# EasyEDA Pro project ProPrj_Practice 4 layer_2025-09-09.epro, schematic 4 Analog Outputs
Board Name: 4 Analog Outputs; Create Date: 2025-08-13; Page Name: P1; Project Name: Practice 4 layer; Schematic Name: 4 Analog Outputs; Update Date: 2025-08-21; Company: EasyEDA.com; Page Size: A4; Version: V1.0
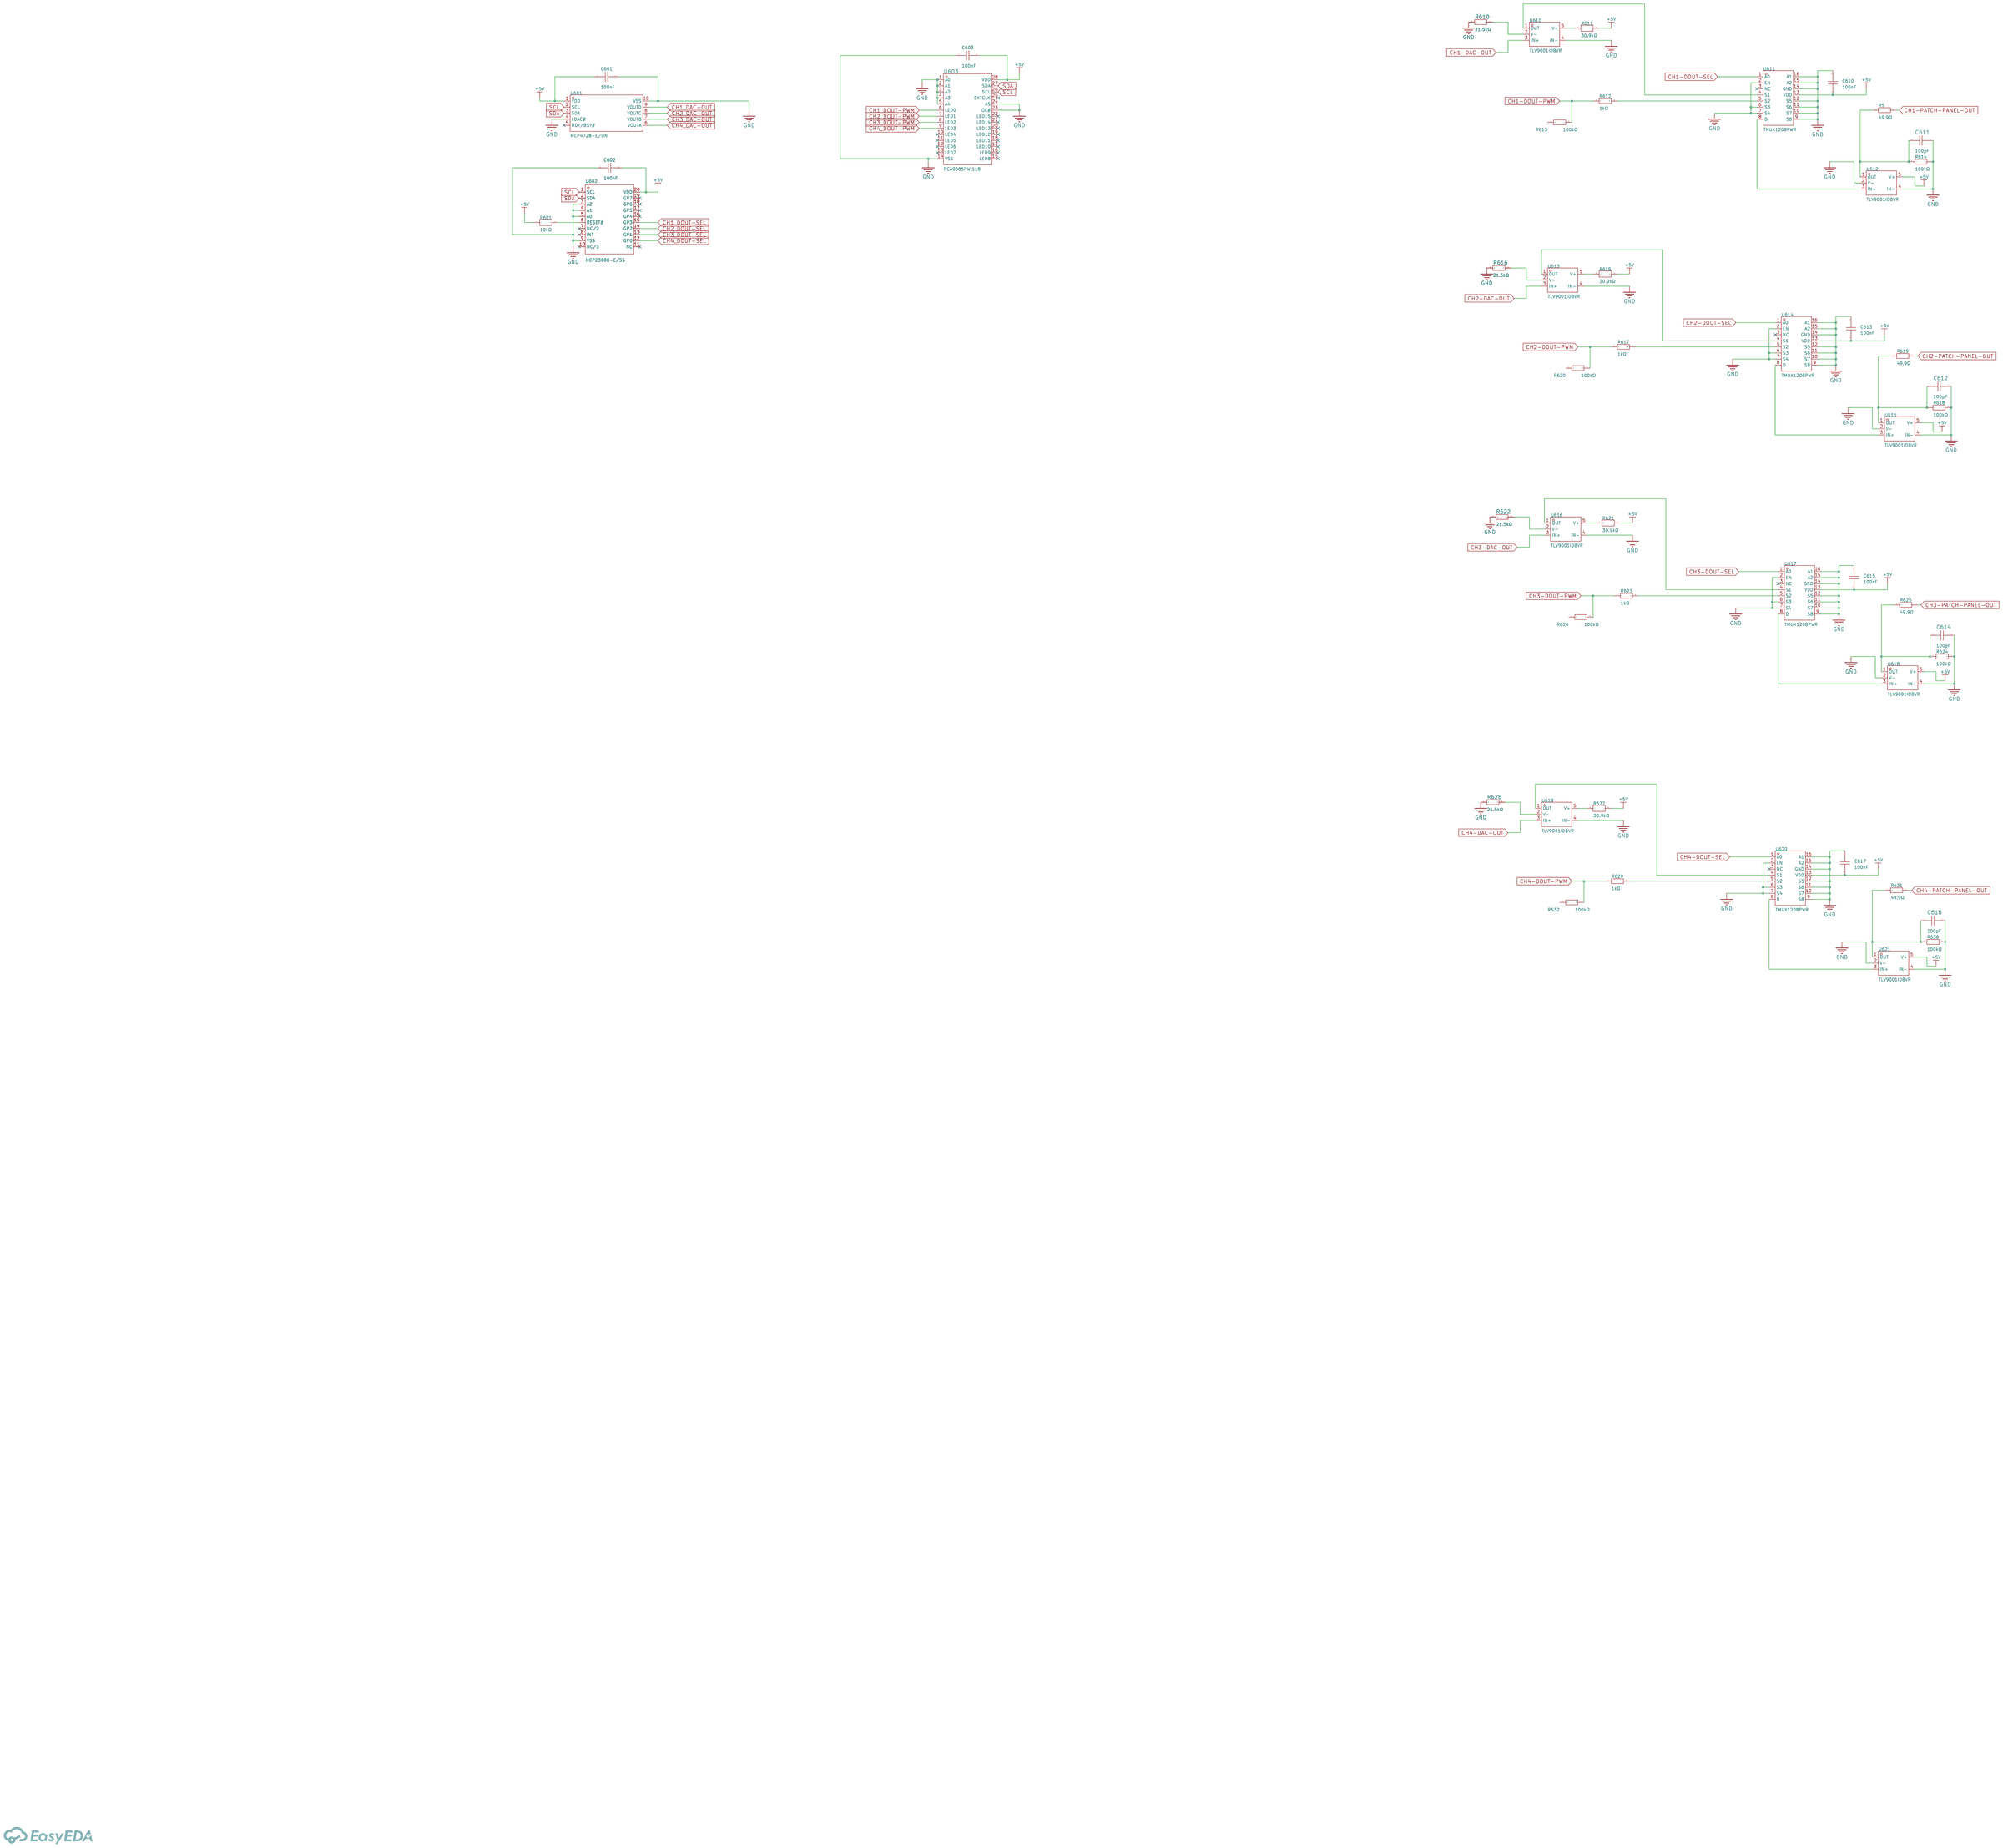
[diagram p8: schematic sheet]

## Parts
C601  100nF  [C0603]
C602  100nF  [C0603]
C603  100nF  [C0603]
C610  100nF  [C0603]
C611  100pF  [C0603]
C612  100pF  [C0603]
C613  100nF  [C0603]
C614  100pF  [C0603]
C615  100nF  [C0603]
C616  100pF  [C0603]
C617  100nF  [C0603]
R5  49.9Ω  [R0603]
R601  10kΩ  [R0603]
R610  21.5kΩ  [R0402]
R611  30.9kΩ  [R0603]
R612  1kΩ  [R0603]
R613  100kΩ  [R0603]
R614  100kΩ  [R0603]
R615  30.9kΩ  [R0603]
R616  21.5kΩ  [R0402]
R617  1kΩ  [R0603]
R618  100kΩ  [R0603]
R619  49.9Ω  [R0603]
R620  100kΩ  [R0603]
R621  30.9kΩ  [R0603]
R622  21.5kΩ  [R0402]
R623  1kΩ  [R0603]
R624  100kΩ  [R0603]
R625  49.9Ω  [R0603]
R626  100kΩ  [R0603]
R627  30.9kΩ  [R0603]
R628  21.5kΩ  [R0402]
R629  1kΩ  [R0603]
R630  100kΩ  [R0603]
R631  49.9Ω  [R0603]
R632  100kΩ  [R0603]
U601  MCP4728-E/UN  [MSOP-10_L3.0-W3.0-P0.50-LS5.0-TL]
U602  MCP23008-E/SS  [SSOP-20_L7.2-W5.3-P0.65-LS7.8-BL]
U603  PCA9685PW,118  [TSSOP-28_L9.7-W4.4-P0.65-LS6.4-TL]
U610  TLV9001IDBVR  [SOT-23-5_L3.0-W1.7-P0.95-LS2.8-BR]
U611  TMUX1208PWR  [TSSOP-16_L5.0-W4.4-P0.65-LS6.4-BL]
U612  TLV9001IDBVR  [SOT-23-5_L3.0-W1.7-P0.95-LS2.8-BR]
U613  TLV9001IDBVR  [SOT-23-5_L3.0-W1.7-P0.95-LS2.8-BR]
U614  TMUX1208PWR  [TSSOP-16_L5.0-W4.4-P0.65-LS6.4-BL]
U615  TLV9001IDBVR  [SOT-23-5_L3.0-W1.7-P0.95-LS2.8-BR]
U616  TLV9001IDBVR  [SOT-23-5_L3.0-W1.7-P0.95-LS2.8-BR]
U617  TMUX1208PWR  [TSSOP-16_L5.0-W4.4-P0.65-LS6.4-BL]
U618  TLV9001IDBVR  [SOT-23-5_L3.0-W1.7-P0.95-LS2.8-BR]
U619  TLV9001IDBVR  [SOT-23-5_L3.0-W1.7-P0.95-LS2.8-BR]
U620  TMUX1208PWR  [TSSOP-16_L5.0-W4.4-P0.65-LS6.4-BL]
U621  TLV9001IDBVR  [SOT-23-5_L3.0-W1.7-P0.95-LS2.8-BR]

## Library data of the parts
C601-C603 C610 C613 C615 C617 = CC0603KRX7R9BB104: Capacitance:100nF Tolerance:±10% Tolerance:±10% Voltage Rating:50V Temperature Coefficient:X7R; LCSC Part Name: 100nF ±10% 50V; Supplier Part: C14663; Manufacturer: YAGEO(国巨); Supplier Footprint: 0603; JLCPCB Part Class: Basic Part; Datasheet: https://atta.szlcsc.com/upload/public/pdf/source/20250214/096C4C206003071F5D32E5F0D8E7F8DF.pdf; Supplier: LCSC; Tolerance: ±10%; Voltage Rating: 50V; Temperature Coefficient: X7R
C611 C612 C614 C616 = CC0603JRNPO9BN101: Capacitance: Tolerance:±5% Tolerance:±5% Voltage Rated: Temperature Coefficient:; LCSC Part Name: 100pF ±5% 50V; Supplier Part: C14665; Manufacturer: YAGEO(国巨); Supplier Footprint: 0603; JLCPCB Part Class: Extended Part; Datasheet: https://atta.szlcsc.com/upload/public/pdf/source/20181008/C309499_21CC21451B82C39E3D92150FD6B30293.pdf; Supplier: LCSC; Tolerance: ±5%
R5 R619 R625 R631 = 0603WAF499JT5E_C23185: Type:Thick Film Resistor Resistance:49.9Ω Tolerance:±1% Tolerance:±1% Power(Watts):100mW Voltage-Supply(Max):75V Temperature Coefficient:±100ppm/℃ Temperature Coefficient:±100ppm/℃ Operating Temperature:-55℃~+155℃ Operating Temperature:-55℃~+155℃; LCSC Part Name: 49.9Ω ±1% 100mW 厚膜电阻; Supplier Part: C23185; Manufacturer: UNI-ROYAL(厚声); Manufacturer Part: 0603WAF499JT5E; Supplier Footprint: 0603; JLCPCB Part Class: Basic Part; Datasheet: https://item.szlcsc.com/datasheet/0603WAF499JT5E/23912.html; Supplier: LCSC; Type: Thick Film Resistor; Tolerance: ±1%; Power(Watts): 100mW; Voltage-Supply(Max): 75V; Temperature Coefficient: ±100ppm/℃; Operating Temperature: -55℃~+155℃
R601 = FRC0603J103 TS: Type:Thick Film Resistors Resistance:10kΩ Tolerance:±5% Tolerance:±5% Power(Watts):0.1W Voltage-Supply(Max):75V Temperature Coefficient:±100ppm/℃ Temperature Coefficient:±100ppm/℃ Operating Temperature:-55℃~+155℃ Operating Temperature:-55℃~+155℃; LCSC Part Name: 10kΩ ±5% 100mW 厚膜电阻; Supplier Part: C2930027; Manufacturer: FOJAN(富捷); Supplier Footprint: 0603; JLCPCB Part Class: Extended Part; Datasheet: https://atta.szlcsc.com/upload/public/pdf/source/20211221/925EC7D7225764EE0046F22065062C87.pdf; Supplier: LCSC; Type: Thick Film Resistors; Tolerance: ±5%; Power(Watts): 0.1W; Voltage-Supply(Max): 75V; Temperature Coefficient: ±100ppm/℃; Operating Temperature: -55℃~+155℃
R610 R616 R622 R628 = 0402WGF2152TCE: Type:Thick Film Resistor Resistance:21.5kΩ Tolerance:±1% Tolerance:±1% Power(Watts):62.5mW Voltage-Supply(Max):50V Temperature Coefficient:±100ppm/℃ Temperature Coefficient:±100ppm/℃ Operating Temperature:-55℃~+155℃ Operating Temperature:-55℃~+155℃; LCSC Part Name: 21.5kΩ ±1% 62.5mW 厚膜电阻; Supplier Part: C25872; Manufacturer: UNI-ROYAL(厚声); Supplier Footprint: 0402; JLCPCB Part Class: Extended Part; Datasheet: https://item.szlcsc.com/datasheet/0402WGF2152TCE/26615.html; Supplier: LCSC; Type: Thick Film Resistor; Tolerance: ±1%; Power(Watts): 62.5mW; Voltage-Supply(Max): 50V; Temperature Coefficient: ±100ppm/℃; Operating Temperature: -55℃~+155℃
R611 R615 R621 R627 = FRC0603F3092TS: Type:Thick Film Resistor Resistance:30.9kΩ Tolerance:±1% Tolerance:±1% Power(Watts):100mW Voltage-Supply(Max):75V Temperature Coefficient:±100ppm/℃ Temperature Coefficient:±100ppm/℃ Operating Temperature:-55℃~+155℃ Operating Temperature:-55℃~+155℃; LCSC Part Name: 30.9kΩ ±1% 100mW 厚膜电阻; Supplier Part: C2930090; Manufacturer: FOJAN(富捷); Supplier Footprint: 0603; JLCPCB Part Class: Extended Part; Datasheet: https://item.szlcsc.com/datasheet/FRC0603F3092TS/3267023.html; Supplier: LCSC; Type: Thick Film Resistor; Tolerance: ±1%; Power(Watts): 100mW; Voltage-Supply(Max): 75V; Temperature Coefficient: ±100ppm/℃; Operating Temperature: -55℃~+155℃
R612 R617 R623 R629 = 0603WAJ0102T5E: Type:Thick Film Resistor Resistance:1kΩ Tolerance:±5% Tolerance:±5% Power(Watts):100mW Voltage-Supply(Max):75V Temperature Coefficient:±100ppm/℃ Temperature Coefficient:±100ppm/℃ Operating Temperature:-55℃~+155℃ Operating Temperature:-55℃~+155℃; LCSC Part Name: 1kΩ ±5% 100mW 厚膜电阻; Supplier Part: C25585; Manufacturer: UNI-ROYAL(厚声); Supplier Footprint: 0603; JLCPCB Part Class: Extended Part; Datasheet: https://item.szlcsc.com/datasheet/0603WAJ0102T5E/26328.html; Supplier: LCSC; Type: Thick Film Resistor; Tolerance: ±5%; Power(Watts): 100mW; Voltage-Supply(Max): 75V; Temperature Coefficient: ±100ppm/℃; Operating Temperature: -55℃~+155℃
R613 R614 R618 R620 R624 R626 R630 R632 = 0603WAF1003T5E: Type:Thick Film Resistors Resistance:100kΩ Tolerance:±1% Tolerance:±1% Power(Watts): Overload Voltage (Max): Temperature Coefficient:±100ppm/℃ Temperature Coefficient:±100ppm/℃ Operating Temperature Range:-55℃~+155℃ Operating Temperature Range:-55℃~+155℃; LCSC Part Name: 100kΩ ±1% 100mW 厚膜电阻; Supplier Part: C25803; Manufacturer: UNI-ROYAL(厚声); Supplier Footprint: 0603; JLCPCB Part Class: Basic Part; Datasheet: https://atta.szlcsc.com/upload/public/pdf/source/20200306/C422600_1E6D84923E4A46A82E41ADD87F860B5C.pdf; Supplier: LCSC; Type: Thick Film Resistors; Tolerance: ±1%; Temperature Coefficient: ±100ppm/℃; Operating Temperature Range: -55℃~+155℃
U601 = MCP4728-E/UN: Resolution(Bits):12Bit Number of Channels:4 Interface:I2C Voltage - Supply:2.7V~5.5V Voltage - Supply:2.7V~5.5V Settling Time:6us Output Type:- INL/DNL(LSB):2LSB INL/DNL(LSB):2LSB Operating Temperature:-40℃~+125℃ Operating Temperature:-40℃~+125℃; LCSC Part Name: F; Supplier Part: C108207; Manufacturer: MICROCHIP(美国微芯); Supplier Footprint: MSOP-10; JLCPCB Part Class: Extended Part; Datasheet: https://atta.szlcsc.com/upload/public/pdf/source/20180207/C108207_15179947749381359004.pdf; Supplier: LCSC; Resolution(Bits): 12Bit; Number of Channels: 4; Interface: I2C; Voltage - Supply: 2.7V~5.5V; Settling Time: 6us; INL/DNL(LSB): 2LSB; Operating Temperature: -40℃~+125℃
U602 = MCP23008-E/SS: Interface:I2C Number of I/O:8 Interrupt Output:With Interrupt Output Output Type: Supply Voltage:- Supply Voltage:- Output Source current:- Output Sink Current:- Clock Frequency:1.7MHz Operating Temperature:- Operating Temperature:-; LCSC Part Name: 8位I/O扩展器带串行接口; Supplier Part: C148011; Manufacturer: MICROCHIP(美国微芯); Supplier Footprint: SSOP-20-208mil; JLCPCB Part Class: Extended Part; Datasheet: https://atta.szlcsc.com/upload/public/pdf/source/20171228/C152205_15144475388971215001.pdf; Supplier: LCSC; Interface: I2C; Number of I/O: 8; Interrupt Output: With Interrupt Output; Clock Frequency: 1.7MHz
U603 = PCA9685PW,118: Type:- Voltage - Input(DC):2.3V~5.5V Voltage - Input(DC):2.3V~5.5V Frequency - Switching:100kHz~1MHz Frequency - Switching:100kHz~1MHz Number of Channels:16 Output Voltage:- Output Voltage:- Output Current:25mA Dimming:PWM Operating temperature:-40℃~+85℃; Supplier Part: C2678753; Manufacturer: NXP(恩智浦); Supplier Footprint: TSSOP-28; JLCPCB Part Class: Extended Part; Datasheet: https://www.nxp.com.cn/docs/en/data-sheet/PCA9685.pdf; Supplier: LCSC; Voltage - Input(DC): 2.3V~5.5V; Frequency - Switching: 100kHz~1MHz; Number of Channels: 16; Output Current: 25mA; Dimming: PWM; Operating temperature: -40℃~+85℃
U610 U612 U613 U615 U616 U618 U619 U621 = TLV9001IDBVR: Number of Channels:Single channel Maximum Power Supply Range (Vdd-Vss):5.5V Rail to Rail:- Gain Bandwidth Product:- Vos - Input Offset Voltage:1.6mV Input Offset Voltage Drift(Vos TC):0.6uV/℃ Slew Rate:2V/us Ib - Input Bias Current:5pA Input Offset Curren; Supplier Part: C398363; Manufacturer: TI(德州仪器); Supplier Footprint: SOT-23-5; JLCPCB Part Class: Extended Part; Datasheet: https://www.ti.com/cn/lit/gpn/tlv9001; Supplier: LCSC; Number of Channels: Single channel; Maximum Power Supply Range (Vdd-Vss): 5.5V; Vos - Input Offset Voltage: 1.6mV; Input Offset Voltage Drift(Vos TC): 0.6uV/℃; Slew Rate: 2V/us; Ib - Input Bias Current: 5pA; Noise density(eN): 4.7nV/√Hz@1kHz; Common Mode Rejection Ratio(CMRR): 86dB; Operating Temperature: -40℃~+125℃; Single supply: 1.8V~5.5V
U611 U614 U617 U620 = TMUX1208PWR: Switch Circuit:SP8T single pole eight throw Number of Channels:8 Supply Voltage:1.08V~5.5V Supply Voltage:1.08V~5.5V Turn-on time:48ns On-State Resistance (Max):9Ω Turn-off time:48ns Operating Temperature:-40℃~+125℃ Operating Temperature:-40℃~+125℃; LCSC Part Name: TMUX1208 5V 双向8:1单通道多路复用器; Supplier Part: C494728; Manufacturer: TI(德州仪器); Supplier Footprint: TSSOP-16; JLCPCB Part Class: Extended Part; Datasheet: https://www.ti.com/cn/lit/gpn/tmux1208; Supplier: LCSC; Switch Circuit: SP8T single pole eight throw; Number of Channels: 8; Supply Voltage: 1.08V~5.5V; Turn-on time: 48ns; On-State Resistance (Max): 9Ω; Turn-off time: 48ns; Operating Temperature: -40℃~+125℃

## Nets
+5V: C601.1 C602.2 C603.2 C610.1 C613.1 C615.1 C617.1 R601.2 R611.1 R615.1 R621.1 R627.1 U601.1(VDD) U602.20(VDD) U603.28(VDD) U611.13(VDD) U612.5(V+) U614.13(VDD) U615.5(V+) U617.13(VDD) U618.5(V+) U620.13(VDD) U621.5(V+)
GND: C601.2 C602.1 C603.1 C610.2 C611.2 C612.2 C613.2 C614.2 C615.2 C616.2 C617.2 R610.2 R614.2 R616.2 R618.2 R622.2 R624.2 R628.2 R630.2 U601.4(LDAC#) U601.10(VSS) U602.3(A2) U602.4(A1) U602.5(A0) U602.9(VSS) U603.1(A0) U603.2(A1) U603.3(A2) U603.4(A3) U603.5(A4) U603.14(VSS) U603.23(OE#) U603.24(A5) U610.4(IN-) U611.2(EN) U611.6(S3) U611.7(S4) U611.9(S8) U611.10(S7) U611.11(S6) U611.12(S5) U611.14(GND) U611.15(A2) U611.16(A1) U612.2(V-) U612.4(IN-) U613.4(IN-) U614.2(EN) U614.6(S3) U614.7(S4) U614.9(S8) U614.10(S7) U614.11(S6) U614.12(S5) U614.14(GND) U614.15(A2) U614.16(A1) U615.2(V-) U615.4(IN-) U616.4(IN-) U617.2(EN) U617.6(S3) U617.7(S4) U617.9(S8) U617.10(S7) U617.11(S6) U617.12(S5) U617.14(GND) U617.15(A2) U617.16(A1) U618.2(V-) U618.4(IN-) U619.4(IN-) U620.2(EN) U620.6(S3) U620.7(S4) U620.9(S8) U620.10(S7) U620.11(S6) U620.12(S5) U620.14(GND) U620.15(A2) U620.16(A1) U621.2(V-) U621.4(IN-)
CH1-DAC-OUT: U610.3(IN+)
CH1-DOUT-PWM: R612.1 R613.2
CH1-DOUT-SEL: U611.1(A0)
CH1-PATCH-PANEL-OUT: R5.2
CH1_DAC-OUT: U601.9(VOUTD)
CH1_DOUT-PWM: U603.6(LED0)
CH1_DOUT-SEL: U602.15(GP3)
CH2-DAC-OUT: U613.3(IN+)
CH2-DOUT-PWM: R617.1 R620.2
CH2-DOUT-SEL: U614.1(A0)
CH2-PATCH-PANEL-OUT: R619.2
CH2_DAC-OUT: U601.8(VOUTC)
CH2_DOUT-PWM: U603.7(LED1)
CH2_DOUT-SEL: U602.14(GP2)
CH3-DAC-OUT: U616.3(IN+)
CH3-DOUT-PWM: R623.1 R626.2
CH3-DOUT-SEL: U617.1(A0)
CH3-PATCH-PANEL-OUT: R625.2
CH3_DAC-OUT: U601.7(VOUTB)
CH3_DOUT-PWM: U603.8(LED2)
CH3_DOUT-SEL: U602.13(GP1)
CH4-DAC-OUT: U619.3(IN+)
CH4-DOUT-PWM: R629.1 R632.2
CH4-DOUT-SEL: U620.1(A0)
CH4-PATCH-PANEL-OUT: R631.2
CH4_DAC-OUT: U601.6(VOUTA)
CH4_DOUT-PWM: U603.9(LED3)
CH4_DOUT-SEL: U602.12(GP0)
SCL: U601.2(SCL) U602.1(SCL) U603.26(SCL)
SDA: U601.3(SDA) U602.2(SDA) U603.27(SDA)
Net-(C611-1): C611.1 R5.1 R614.1 U612.1(OUT)
Net-(C612-1): C612.1 R618.1 R619.1 U615.1(OUT)
Net-(C614-1): C614.1 R624.1 R625.1 U618.1(OUT)
Net-(C616-1): C616.1 R630.1 R631.1 U621.1(OUT)
Net-(R601-1): R601.1 U602.6(RESET#)
Net-(R610-1): R610.1 U610.2(V-)
Net-(R611-2): R611.2 U610.5(V+)
Net-(R612-2): R612.2 U611.5(S2)
Net-(R615-2): R615.2 U613.5(V+)
Net-(R616-1): R616.1 U613.2(V-)
Net-(R617-2): R617.2 U614.5(S2)
Net-(R621-2): R621.2 U616.5(V+)
Net-(R622-1): R622.1 U616.2(V-)
Net-(R623-2): R623.2 U617.5(S2)
Net-(R627-2): R627.2 U619.5(V+)
Net-(R628-1): R628.1 U619.2(V-)
Net-(R629-2): R629.2 U620.5(S2)
Net-(U610-1): U610.1(OUT) U611.4(S1)
Net-(U611-8): U611.8(D) U612.3(IN+)
Net-(U613-1): U613.1(OUT) U614.4(S1)
Net-(U614-8): U614.8(D) U615.3(IN+)
Net-(U616-1): U616.1(OUT) U617.4(S1)
Net-(U617-8): U617.8(D) U618.3(IN+)
Net-(U619-1): U619.1(OUT) U620.4(S1)
Net-(U620-8): U620.8(D) U621.3(IN+)

Not connected (* = marked no-connect by the designer): R613 1; R620 1; R626 1; R632 1; U601 5(RDY/BSY#)*; U602 7(NC/2)* 8(INT)* 10(NC/3)* 11(NC)* 16(GP4)* 17(GP5)* 18(GP6)* 19(GP7)*; U603 10(LED4)* 11(LED5)* 12(LED6)* 13(LED7)* 15(LED8)* 16(LED9)* 17(LED10)* 18(LED11)* 19(LED12)* 20(LED13)* 21(LED14)* 22(LED15)* 25(EXTCLK)*; U611 3(NC)*; U614 3(NC)*; U617 3(NC)*; U620 3(NC)*
